# Altium schematic sheet [4]-RF.SchDoc
size A4
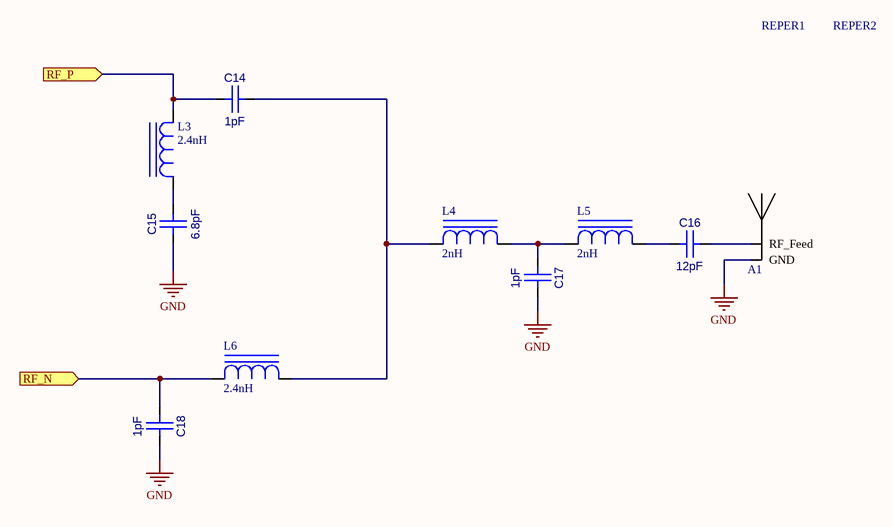
[diagram p0: [4]-RF.SchDoc]

## Parts
A1  Antenna Wi-Fi  [Antenna_WiFi]  (value not drawn)
C14  1pF  [CC0603]
C15  6.8pF  [CC0603]
C16  12pF  [CC0603]
C17  1pF  [CC0603]
C18  1pF  [CC0603]
L3  2.4nH  [L0402]
L4  2nH  [L0402]
L5  2nH  [L0402]
L6  2.4nH  [L0402]
REPER1  REPER1.2  [REPER1.2]  (value not drawn)
REPER2  REPER1.2  [REPER1.2]  (value not drawn)

## Ports
RF_N (in), RF_P (in)

## Nets
GND: A1.2(GND) C15.1(A) C17.2(B) C18.2(B)
RF_N: C18.1(A) L6.1(A) ; port RF_N
RF_P: C14.1(A) L3.2(C) ; port RF_P
NetA1_1: A1.1(RF_Feed) C16.2(B)
NetC14_2: C14.2(B) L4.1(A) L6.2(C)
NetC15_2: C15.2(B) L3.1(A)
NetC16_1: C16.1(A) L5.2(C)
NetC17_1: C17.1(A) L4.2(C) L5.1(A)

Not connected (* = marked no-connect by the designer): REPER1 1; REPER2 1

## Library data of the parts
A1 = Antenna Wi-Fi: 2.43GHz
C14-C18 = CC0603
  C14 C17 C18: Value: 1pF
  C15: Value: 6.8pF
  C16: Value: 12pF
L3-L6 = L0402
  L3 L6: Value: 2.4nH
  L4 L5: Value: 2nH
REPER1 REPER2 = REPER1.2: Value: *